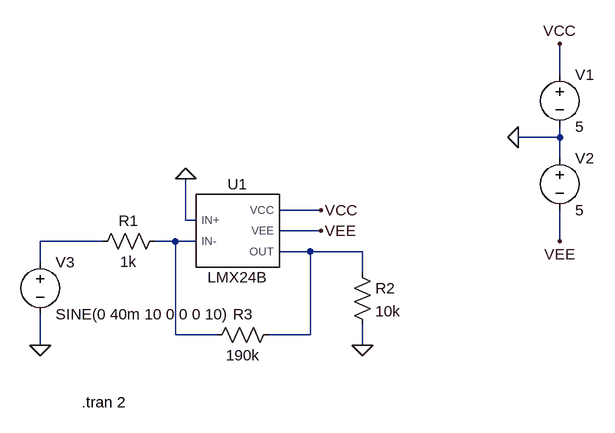
[diagram p0: schematic OP LMx24b test.asc]
OP LMx24b test.asc, the LTspice schematic file:
Version 4.1
SHEET 1 880 680
WIRE 624 -96 624 -144
WIRE 624 0 624 -16
WIRE 624 0 560 0
WIRE 624 32 624 0
WIRE 256 112 192 112
WIRE 48 128 48 64
WIRE 64 128 48 128
WIRE 256 144 192 144
WIRE -80 160 -176 160
WIRE 32 160 0 160
WIRE 64 160 32 160
WIRE 624 160 624 112
WIRE 240 176 192 176
WIRE 320 176 240 176
WIRE -176 192 -176 160
WIRE 320 208 320 176
WIRE 32 304 32 160
WIRE 96 304 32 304
WIRE 240 304 240 176
WIRE 240 304 176 304
WIRE -176 320 -176 272
WIRE 320 320 320 288
FLAG 560 0 0
FLAG 624 160 VEE
FLAG 256 144 VEE
FLAG 624 -144 VCC
FLAG 256 112 VCC
FLAG 48 64 0
FLAG -176 320 0
FLAG 320 320 0
SYMBOL LMX24B 128 144 R0
SYMATTR InstName U1
SYMBOL voltage 624 -112 R0
WINDOW 123 0 0 Left 0
WINDOW 39 0 0 Left 0
SYMATTR InstName V1
SYMATTR Value 5
SYMBOL voltage 624 16 R0
WINDOW 123 0 0 Left 0
WINDOW 39 0 0 Left 0
SYMATTR InstName V2
SYMATTR Value 5
SYMBOL voltage -176 176 R0
WINDOW 123 0 0 Left 0
WINDOW 39 0 0 Left 0
SYMATTR InstName V3
SYMATTR Value SINE(0 40m 10 0 0 0 10)
SYMBOL res 16 144 R90
WINDOW 0 0 56 VBottom 2
WINDOW 3 32 56 VTop 2
SYMATTR InstName R1
SYMATTR Value 1k
SYMBOL res 304 192 R0
SYMATTR InstName R2
SYMATTR Value 10k
SYMBOL res 192 288 R90
WINDOW 0 0 56 VBottom 2
WINDOW 3 32 56 VTop 2
SYMATTR InstName R3
SYMATTR Value 190k
TEXT -112 408 Left 2 !.tran 2

The netlist it stands for:
* OP LMx24b test.asc
X§U1 0 N002 VCC VEE N003 LMX24B  ; pins IN+ IN- VCC VEE OUT
V1 VCC 0 5
V2 0 VEE 5
V3 N001 0 SINE(0 40m 10 0 0 0 10)
R1 N002 N001 1k
R2 N003 0 10k
R3 N003 N002 190k
.tran 2
.lib LMX24B.cir
.backanno
.end